# Altium schematic sheet compute module.SchDoc: Compute Module
size A4; Organization: Blinkinlabs, LLC; DocumentNumber: 2; SheetNumber: 2; SheetTotal: 14
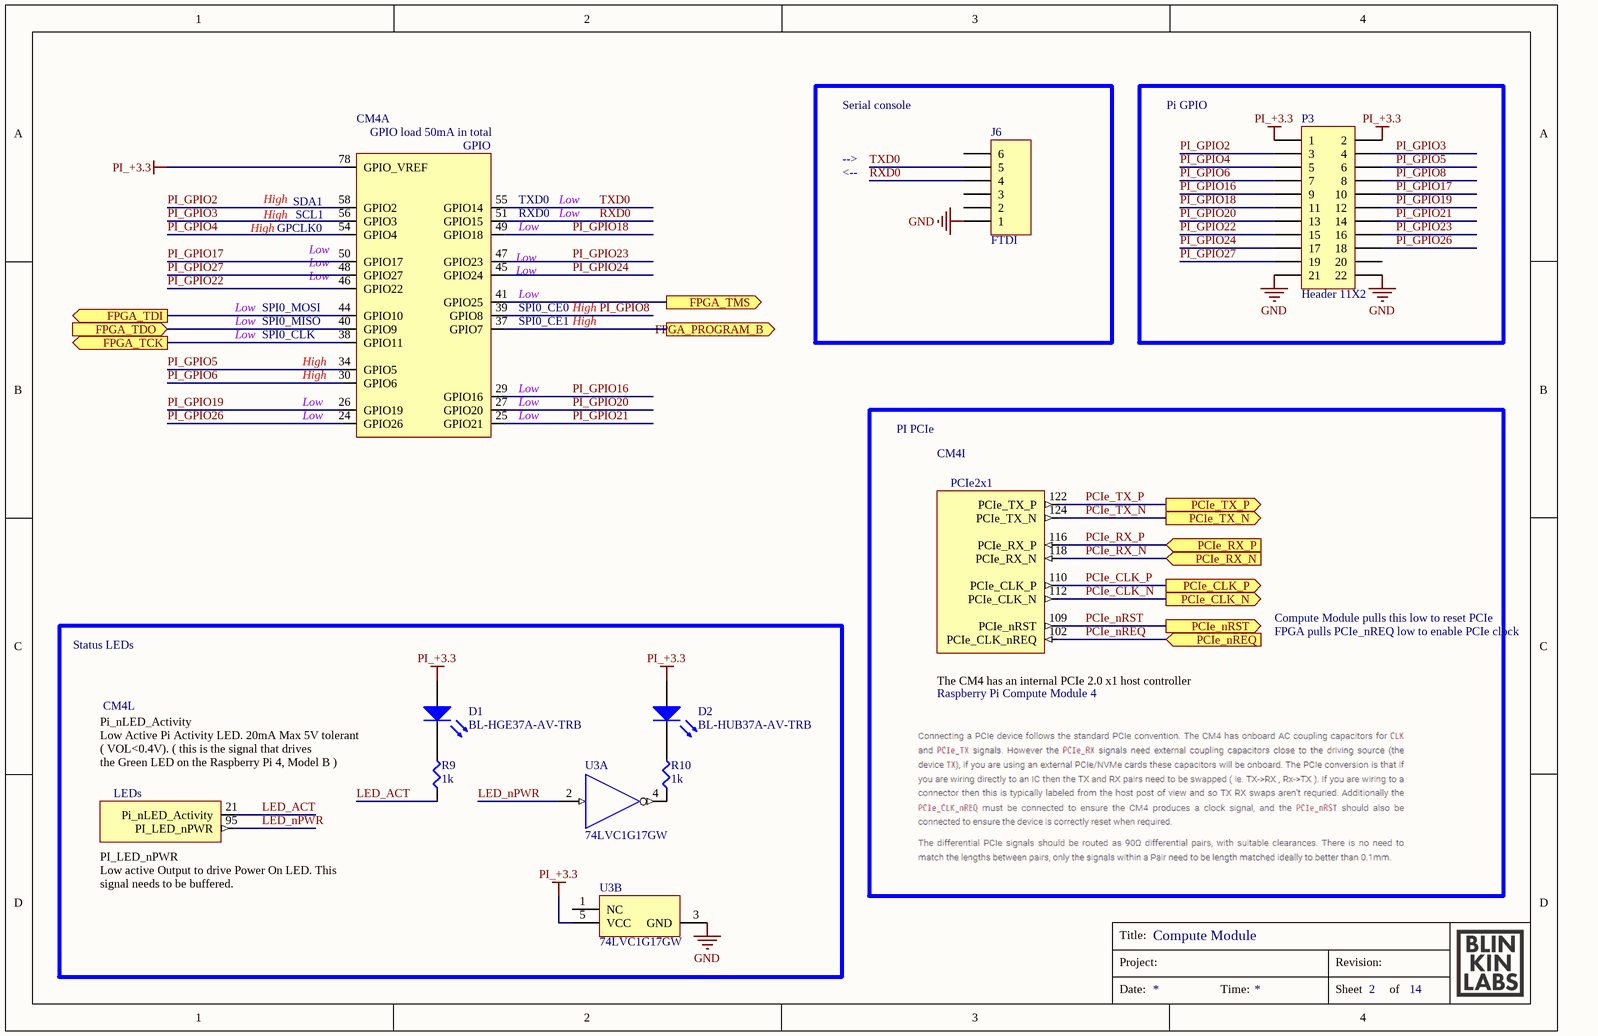
[diagram p0: compute module.SchDoc]

## Parts
CM4  Raspberry Pi Compute Module 4  [CM4-F40C-100DS-0.4v_1.5mm_0mm]  (value not drawn)  (parts A,I,L of 21)
D1  BL-HGE37A-AV-TRB  [BL-Hxx37A-AV-TRB]
D2  BL-HUB37A-AV-TRB  [BL-Hxx37A-AV-TRB]
J6  FTDI  [HDR1X6]
P3  Header 11X2  [HDR2X11]
R9  1k  [ERJ2G(0402)_L]
R10  1k  [ERJ2G(0402)_L]
U3  74LVC1G17GW  [NXP-SOT353-1_L]  (parts A,B of 2)

## Blocks framed on the sheet
Pi GPIO: P3
Status LEDs: CM4 D1 D2 R9 R10 U3

## Ports
FPGA_PROGRAM_B (out), FPGA_TCK (out), FPGA_TDI (out), FPGA_TDO (in), FPGA_TMS (out), PCIe_CLK_N (out), PCIe_CLK_P (out), PCIe_nREQ (in), PCIe_nRST (out), PCIe_RX_N (in), PCIe_RX_P (in), PCIe_TX_N (out), PCIe_TX_P (out)

## Nets
GND: J6.1 P3.21 P3.22 U3.3(GND)
PI_+3.3: CM4.78(GPIO_VREF) D1.1 D2.1 P3.1 P3.2 U3.5(VCC)
FPGA_PROGRAM_B: CM4.37(GPIO7) ; port FPGA_PROGRAM_B
FPGA_TCK: CM4.38(GPIO11) ; port FPGA_TCK
FPGA_TDI: CM4.44(GPIO10) ; port FPGA_TDI
FPGA_TDO: CM4.40(GPIO9) ; port FPGA_TDO
FPGA_TMS: CM4.41(GPIO25) ; port FPGA_TMS
LED_ACT: CM4.21(Pi_nLED_Activity) R9.1
LED_nPWR: CM4.95(PI_LED_nPWR) U3.2(A)
PCIe_CLK_N: CM4.112(PCIe_CLK_N) ; port PCIe_CLK_N
PCIe_CLK_P: CM4.110(PCIe_CLK_P) ; port PCIe_CLK_P
PCIe_nREQ: CM4.102(PCIe_CLK_nREQ) ; port PCIe_nREQ
PCIe_nRST: CM4.109(PCIe_nRST) ; port PCIe_nRST
PCIe_RX_N: CM4.118(PCIe_RX_N) ; port PCIe_RX_N
PCIe_RX_P: CM4.116(PCIe_RX_P) ; port PCIe_RX_P
PCIe_TX_N: CM4.124(PCIe_TX_N) ; port PCIe_TX_N
PCIe_TX_P: CM4.122(PCIe_TX_P) ; port PCIe_TX_P
PI_GPIO2: CM4.58(GPIO2) P3.3
PI_GPIO3: CM4.56(GPIO3) P3.4
PI_GPIO4: CM4.54(GPIO4) P3.5
PI_GPIO5: CM4.34(GPIO5) P3.6
PI_GPIO6: CM4.30(GPIO6) P3.7
PI_GPIO8: CM4.39(GPIO8) P3.8
PI_GPIO16: CM4.29(GPIO16) P3.9
PI_GPIO17: CM4.50(GPIO17) P3.10
PI_GPIO18: CM4.49(GPIO18) P3.11
PI_GPIO19: CM4.26(GPIO19) P3.12
PI_GPIO20: CM4.27(GPIO20) P3.13
PI_GPIO21: CM4.25(GPIO21) P3.14
PI_GPIO22: CM4.46(GPIO22) P3.15
PI_GPIO23: CM4.47(GPIO23) P3.16
PI_GPIO24: CM4.45(GPIO24) P3.17
PI_GPIO26: CM4.24(GPIO26) P3.18
PI_GPIO27: CM4.48(GPIO27) P3.19
RXD0: CM4.51(GPIO15) J6.4
TXD0: CM4.55(GPIO14) J6.5
NetD1_2: D1.2 R9.2
NetD2_2: D2.2 R10.2
NetR10_1: R10.1 U3.4(~{Y})

Not connected (* = marked no-connect by the designer): J6 2 3 6; P3 20; U3 1(NC)

## Notes on the sheet
- Serial console
- <--
- -->
- PI PCIe
- Compute Module pulls this low to reset PCIe
- FPGA pulls PCIe_nREQ low to enable PCIe clock
- Title:
- Project:
- Revision:
- Date:
- Time:
- Sheet
- of
- (in symbol CM4, part A) GPIO load 50mA in total; GPIO; High; SDA1; TXD0; Low; SCL1; RXD0; GPCLK0; SPI0_MOSI; SPI0_CE0; SPI0_MISO; SPI0_CE1; SPI0_CLK; by Amornthep Phunsin
- (in symbol CM4, part I) PCIe2x1; The CM4 has an internal PCIe 2.0 x1 host controller
- (in symbol CM4, part L) Pi_nLED_Activity / Low Active Pi Activity LED. 20mA Max 5V tolerant ( VOL<0.4V). ( this is the signal that drives / the Green LED on the Raspberry Pi 4, Model B ); LEDs; PI_LED_nPWR / Low active Output to drive Power On LED. This signal needs to be buffered.

## Library data of the parts
CM4 = CM4: Raspberry Pi Compute Module 4 by Amornthep Phunsin
D1 = BL-HGE37A-AV-TRB: LED, 0402, Super Yellow Green, 35mcd@20mA, 566~576nm; Manufacturer: BrtLed(佰鸿); PartNumber: BL-HGE37A-AV-TRB; LCSC PartNumber: C165979
D2 = BL-HUB37A-AV-TRB: LED, 0402, Super Red, 50mcd@20mA, 627~637nm; Manufacturer: BrtLed(佰鸿); PartNumber: BL-HUB37A-AV-TRB; LCSC PartNumber: C165980
J6 = Header 6: Header, 6-Pin; LatestRevisionDate: 17-Jul-2002; LatestRevisionNote: Re-released for DXP Platform.; Publisher: Altium Limited
P3 = Header 11X2: Header, 11-Pin, Dual row; LatestRevisionDate: 17-Jul-2002; LatestRevisionNote: Re-released for DXP Platform.; Publisher: Altium Limited
R9 R10 = ERJ-2GEJ102X: RES SMD 1K OHM 5% 1/10W 0402; Manufacturer: Panasonic Electronic Components; Power (Watts): 0.1W, 1/10W; Temperature Coefficient: ±200ppm/°C; PartNumber: ERJ-2GEJ102X; Datasheets: http://industrial.panasonic.com/www-cgi/jvcr13pz.cgi?E+PZ+3+AOA0001+ERJ2GEJ102X+7+WW; Image: //media.digikey.com/Photos/Panasonic%20Photos/ERJ-PA2-Series.jpg; Digi-Key Part Number: P1.0KJCT-ND; Series: ERJ; Value: 1k; Tolerance: ±5%; Composition: Thick Film; Features: Automotive AEC-Q200; Operating Temperature: -55°C ~ 155°C; Package / Case: 0402 (1005 Metric); Case/Package: 0402; Size / Dimension: 0.039" L x 0.020" W (1.00mm x 0.50mm); Height - Seated (Max): 0.016" (0.40mm); Number of Terminations: 2
U3 = CMP-2000-05689-1: Single Schmitt Trigger Buffer, 1.65 to 5.5 V, -40 to 125 degC, 5-Pin TSSOP (SOT353-1), RoHS, Tape and Reel; Manufacturer: NXP Semiconductors; Output Type: SingleEnded; Maximum High Level Output Current: -32mA; Maximum Propagation Delay Time @ Maximum CL: 14ns; Maximum Operating Supply Voltage: 5.5V; Schmitt Trigger Input: Yes; Number of Channels: 1; Minimum Operating Supply Voltage: 1.65V; Polarity: Non-Inverting; Logic Family: LVC; Maximum Low Level Output Current: 32mA; Width: 1.35mm; Maximum Operating Temperature: +125°C; Package Description: 5-Pin Thin Shrink Small Outline Package, Body 2.05 x 1.25 mm, Pitch 0.65 mm; Length: 2.25mm; Package Type: TSSOP; Dimensions: 2.25x1.35x1mm; Datasheet URL: http://www.nxp.com/documents/data_sheet/74LVC1G17.pdf?fasp=1&WT_TYPE=Data%20Sheets&WT_VENDOR=FREESCALE&WT_FILE_FORMAT=pdf&WT_ASSET=Documentation&fileExt=.pdf; Package Reference: SOT353-1; Mounting Technology: SurfaceMount; Logic Function: Buffer; Package URL: http://www.nxp.com/documents/outline_drawing/SOT353-1.pdf; Input Type: SchmittTrigger; Mounting Type: SurfaceMount; Datasheet Version: Rev. 10, 06/2012; Manufacturer URL: http://www.nxp.com/; Pin Count: 5; Height: 1mm; Minimum Operating Temperature: -40°C; PartId: 1